# Altium schematic sheet TimeCounter.SchDoc: LiveDesign Evaluation - Alarm Clock
size A4; Organization: Altium Limited; Address1: L3, 12a Rodborough Rd; Address2: Frenchs Forest; Address3: NSW; Address4: Australia 2086; DocumentNumber: 4; SheetNumber: 4; SheetTotal: 10
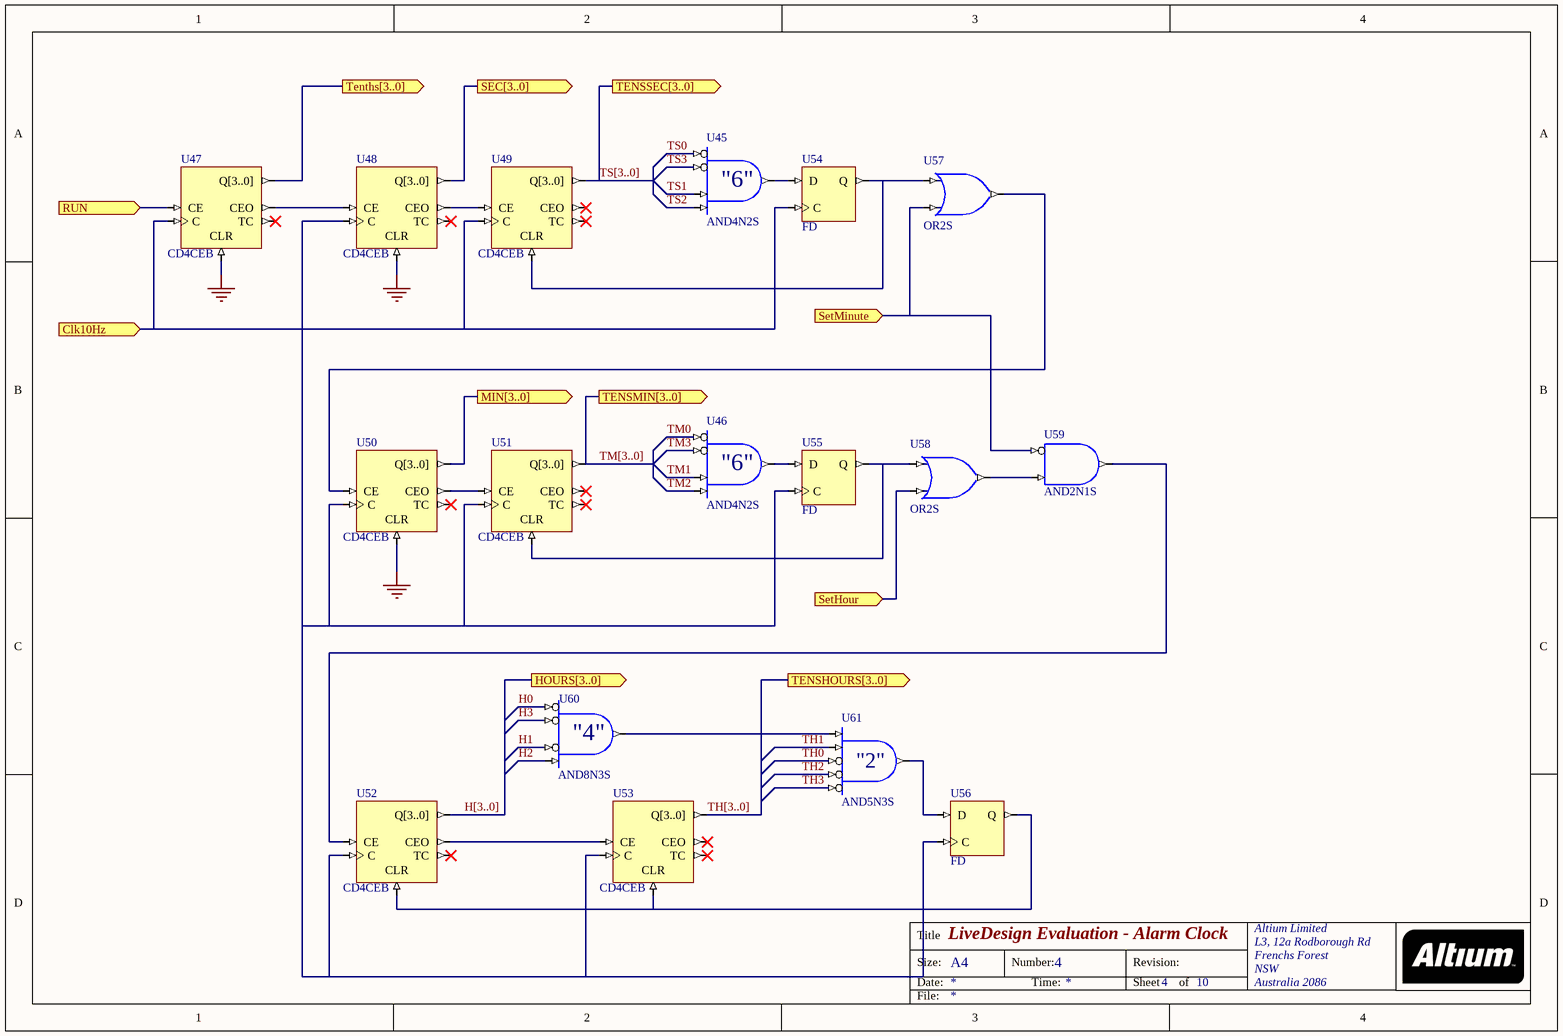
[diagram p0: TimeCounter.SchDoc]

## Parts
U45  AND4N2S
U46  AND4N2S
U47  CD4CEB
U48  CD4CEB
U49  CD4CEB
U50  CD4CEB
U51  CD4CEB
U52  CD4CEB
U53  CD4CEB
U54  FD
U55  FD
U56  FD
U57  OR2S
U58  OR2S
U59  AND2N1S
U60  AND8N3S
U61  AND5N3S

## Ports
Clk10Hz (in), HOURS[3..0] (out), MIN[3..0] (out), RUN (in), SEC[3..0] (out), SetHour (in), SetMinute (in), TENSHOURS[3..0] (out), TENSMIN[3..0] (out), TENSSEC[3..0] (out), Tenths[3..0] (out)

## Nets
GND: U47.CLR U48.CLR U50.CLR
Clk10Hz: U47.C U48.C U49.C U50.C U51.C U52.C U53.C U54.C U55.C U56.C ; port Clk10Hz
H0: U60.I0
H1: U60.I2
H2: U60.I3
H3: U60.I1
H[3..0]: U52.Q[3..0] ; port HOURS[3..0]
MIN[3..0]: U50.Q[3..0] ; port MIN[3..0]
RUN: U47.CE ; port RUN
SEC[3..0]: U48.Q[3..0] ; port SEC[3..0]
SetHour: U58.I1 ; port SetHour
SetMinute: U57.I1 U59.I0 ; port SetMinute
Tenths[3..0]: U47.Q[3..0] ; port Tenths[3..0]
TH0: U61.I2
TH1: U61.I3
TH2: U61.I1
TH3: U61.I0
TH[3..0]: U53.Q[3..0] ; port TENSHOURS[3..0]
TM0: U46.I0
TM1: U46.I2
TM2: U46.I3
TM3: U46.I1
TM[3..0]: U51.Q[3..0] ; port TENSMIN[3..0]
TS0: U45.I0
TS1: U45.I2
TS2: U45.I3
TS3: U45.I1
TS[3..0]: U49.Q[3..0] ; port TENSSEC[3..0]
NetU45_O: U45.O U54.D
NetU46_O: U46.O U55.D
NetU47_CEO: U47.CEO U48.CE
NetU48_CEO: U48.CEO U49.CE
NetU49_CLR: U49.CLR U54.Q U57.I0
NetU50_CE: U50.CE U57.O
NetU50_CEO: U50.CEO U51.CE
NetU51_CLR: U51.CLR U55.Q U58.I0
NetU52_CE: U52.CE U59.O
NetU52_CEO: U52.CEO U53.CE
NetU52_CLR: U52.CLR U53.CLR U56.Q
NetU56_D: U56.D U61.O
NetU58_O: U58.O U59.I1
NetU60_O: U60.O U61.I4

Not connected (* = marked no-connect by the designer): U47 TC*; U48 TC*; U49 CEO* TC*; U50 TC*; U51 CEO* TC*; U52 TC*; U53 CEO* TC*

## Buses and harness runs
bus H[3..0] = port HOURS[3..0]
bus TH[3..0] = port TENSHOURS[3..0]
bus TM[3..0] = port TENSMIN[3..0]
bus TS[3..0] = port TENSSEC[3..0]

## Notes on the sheet
- (near U45) "6"
- (near U46) "6"
- (near U60) "4"
- (near U61) "2"
- Title
- Size:
- Date:
- A4
- Number:
- Time:
- Revision:
- Sheet
- of
- File:

## Library data of the parts
U45 U46 = AND4N2S: 4-Input AND Gate with Active Low A and B Inputs, Single Pin Version; Xilinx Equivalent: AND4B2; ArchiveName: GENERIC; VHDLIB_SIM: GENERIC_LIB; Published: 29-Jan-2004; Publisher: Altium Limited; Core Revision: 1.00.00
U47-U53 = CD4CEB: Cascadable BCD Counter with Clock Enable and Asynchronous Clear, Bus Version; ArchiveName: GENERIC; VHDLIB_SIM: GENERIC_LIB; Published: 29-Jan-2004; Publisher: Altium Limited; Core Revision: 1.00.00
U54-U56 = FD: D-Type Flip-Flop; ArchiveName: GENERIC; VHDLIB_SIM: GENERIC_LIB; Published: 29-Jan-2004; Publisher: Altium Limited; Xilinx Equivalent: FD; Core Revision: 1.00.00
U57 U58 = OR2S: 2-Input OR Gate, Single Pin Version; Xilinx Equivalent: OR2; ArchiveName: GENERIC; VHDLIB_SIM: GENERIC_LIB; Published: 29-Jan-2004; Publisher: Altium Limited; Core Revision: 1.00.00
U59 = AND2N1S: 2-Input AND Gate with Active Low A Input, Single Pin Version; Xilinx Equivalent: AND2B1; ArchiveName: GENERIC; VHDLIB_SIM: GENERIC_LIB; Published: 29-Jan-2004; Publisher: Altium Limited; Core Revision: 1.00.00
U60 = AND4N3S: 4-Input AND Gate with Active Low A, B and C Inputs, Single Pin Version; Xilinx Equivalent: AND4B3; ArchiveName: GENERIC; VHDLIB_SIM: GENERIC_LIB; Published: 29-Jan-2004; Publisher: Altium Limited; Core Revision: 1.00.00
U61 = AND5N3S: 5-Input AND Gate with Active Low A, B and C Inputs, Single Pin Version; Xilinx Equivalent: AND5B3; ArchiveName: GENERIC; VHDLIB_SIM: GENERIC_LIB; Published: 29-Jan-2004; Publisher: Altium Limited; Core Revision: 1.00.00